# EAGLE design e-cig_controller (EAGLE 7.2.0)

## Sheet 1 of 3: USB Charger
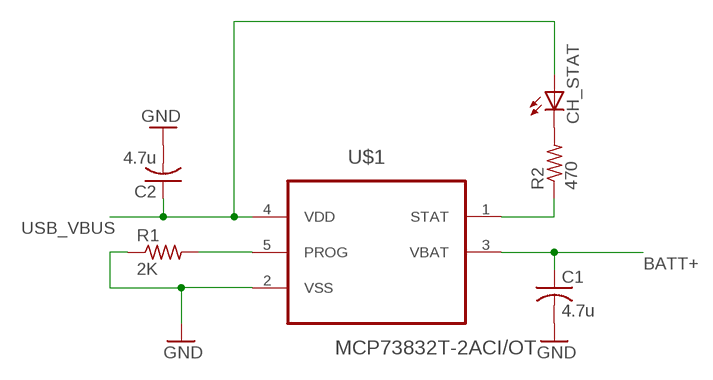
[diagram p0: schematic, sheet 1]

### Parts
C1  4.7u  C-USC0603  [C0603]
C2  4.7u  C-USC0603  [C0603]
CH_STAT  LEDCHIP-LED0603  [CHIP-LED0603]
R1  2K  R-US_R0603  [R0603]
R2  470  R-US_R0603  [R0603]
U$1  MCP73832T-2ACI/OT  [SOT95P280X145-5N]

### Nets
BATT+: C1.1 U$1.3(VBAT) ; also sheet 2
GND: C1.2 C2.2 R1.1 U$1.2(VSS) ; also sheet 2,3
N$2: R1.2 U$1.5(PROG)
N$3: CH_STAT.C R2.2
N$4: R2.1 U$1.1(STAT)
USB_VBUS: C2.1 CH_STAT.A U$1.4(VDD)

## Sheet 2 of 3: Power
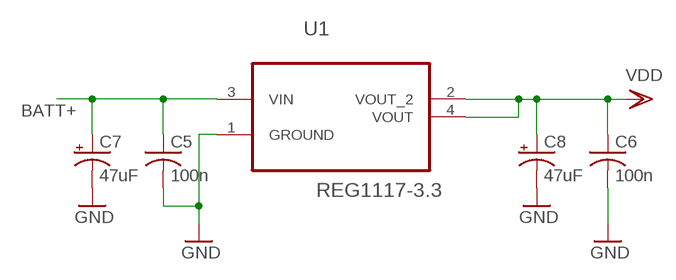
[diagram p1: schematic, sheet 2]

### Parts
C5  100n  C-USC0603  [C0603]
C6  100n  C-USC0603  [C0603]
C7  47uF  CPOL-USA/3216-18W  [A/3216-18W]
C8  47uF  CPOL-USA/3216-18W  [A/3216-18W]
U1  REG1117-3.3  [SOT230P700X180-4N]

### Nets
BATT+: C5.1 C7.+ U1.3(VIN) ; also sheet 1
GND: C5.2 C6.2 C7.- C8.- U1.1(GROUND) ; also sheet 1,3
VDD: C6.1 C8.+ U1.2(VOUT_2) U1.4(VOUT)

## Sheet 3 of 3: MCU
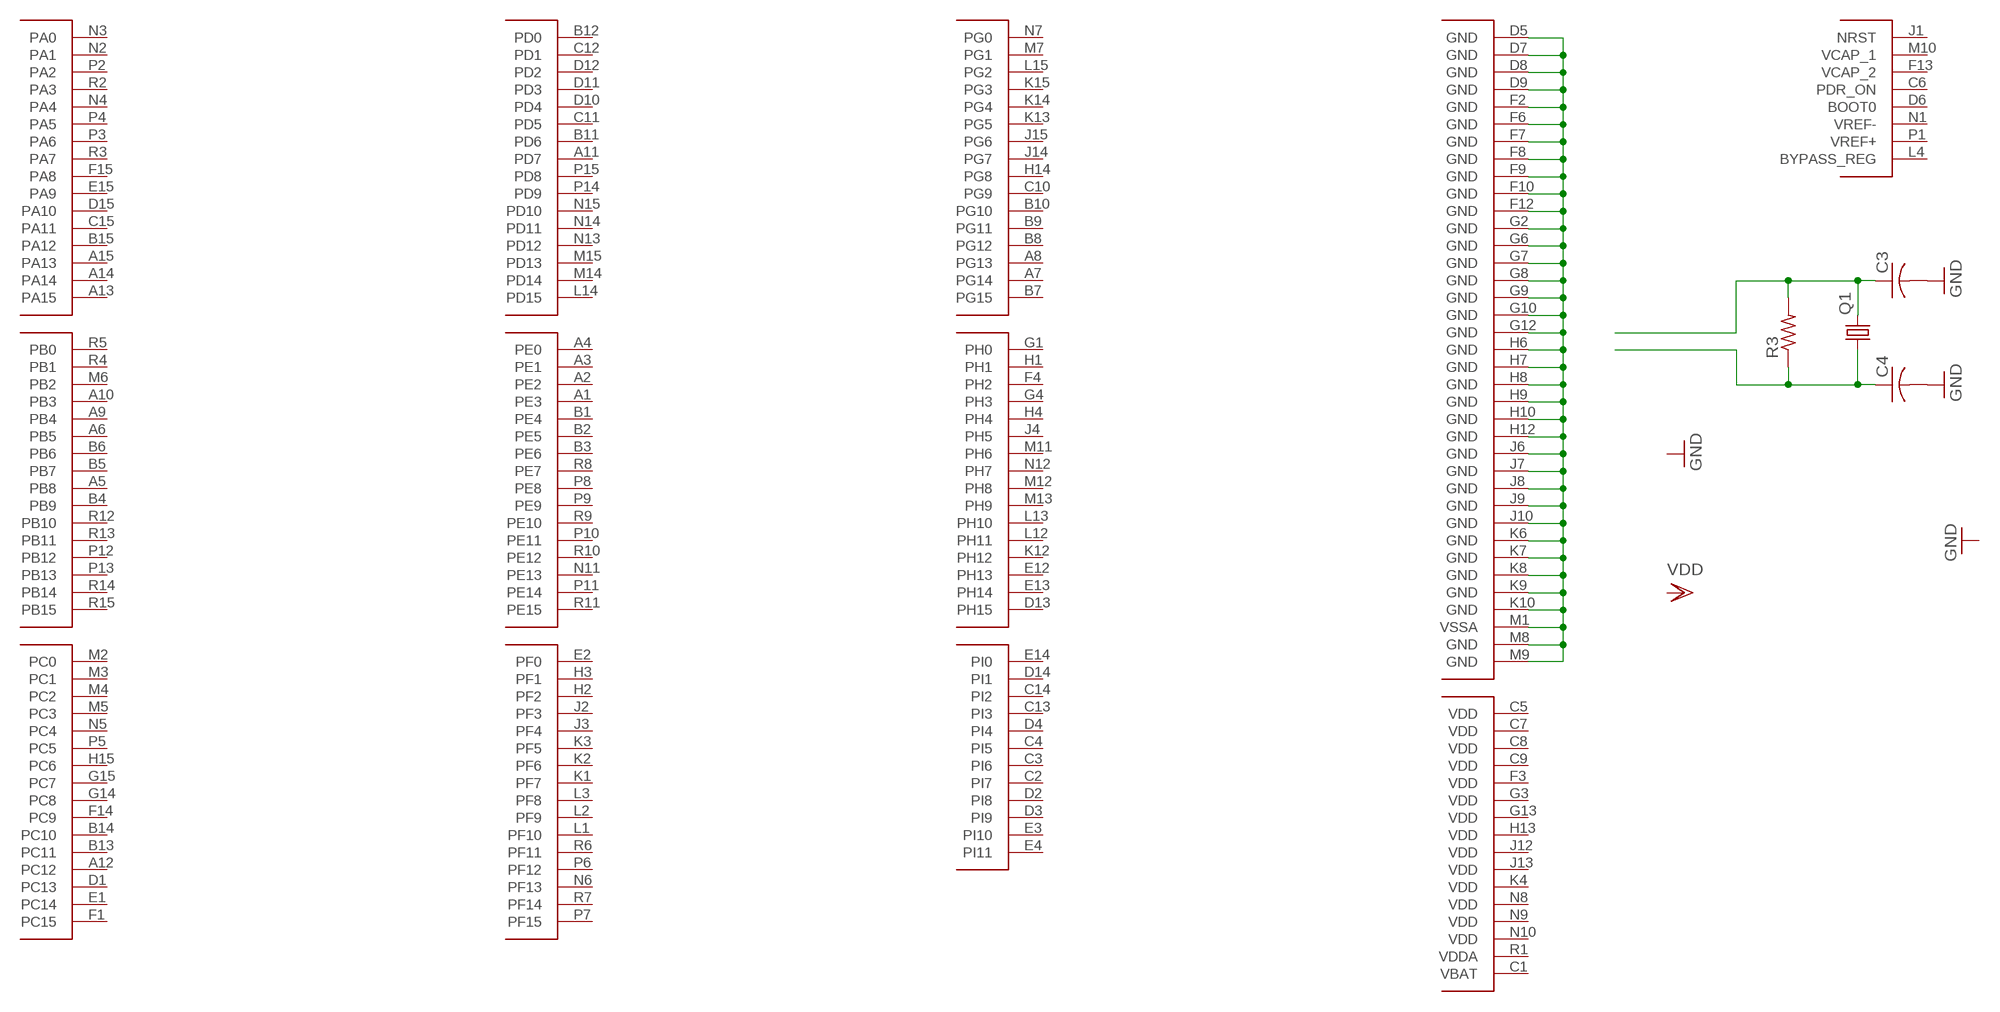
[diagram p2: schematic, sheet 3]

### Parts
C3  C-USC0603  [C0603]
C4  C-USC0603  [C0603]
Q1  CRYSTALHC49US  [HC49US]
R3  R-US_R0603  [R0603]
U$2  STM32F407IG  [UFBGA176+25]

### Nets
GND: C3.2 C4.2 ; also sheet 1,2
N$1: U$2.D5(GND) U$2.D7(GND) U$2.D8(GND) U$2.D9(GND) U$2.F2(GND) U$2.F6(GND) U$2.F7(GND) U$2.F8(GND) U$2.F9(GND) U$2.F10(GND) U$2.F12(GND) U$2.G2(GND) U$2.G6(GND) U$2.G7(GND) U$2.G8(GND) U$2.G9(GND) U$2.G10(GND) U$2.G12(GND) U$2.H6(GND) U$2.H7(GND) U$2.H8(GND) U$2.H9(GND) U$2.H10(GND) U$2.H12(GND) U$2.J6(GND) U$2.J7(GND) U$2.J8(GND) U$2.J9(GND) U$2.J10(GND) U$2.K6(GND) U$2.K7(GND) U$2.K8(GND) U$2.K9(GND) U$2.K10(GND) U$2.M1(VSSA) U$2.M8(GND) U$2.M9(GND)
N$6: C3.1 Q1.2 R3.2
N$7: C4.1 Q1.1 R3.1
Unconnected: U$2.A1(PE3) U$2.A2(PE2) U$2.A3(PE1) U$2.A4(PE0) U$2.A5(PB8) U$2.A6(PB5) U$2.A7(PG14) U$2.A8(PG13) U$2.A9(PB4) U$2.A10(PB3) U$2.A11(PD7) U$2.A12(PC12) U$2.A13(PA15) U$2.A14 U$2.A15(PA13) U$2.B1(PE4) U$2.B2(PE5) U$2.B3(PE6) U$2.B4(PB9) U$2.B5(PB7) U$2.B6 U$2.B7(PG15) U$2.B8(PG12) U$2.B9(PG11) U$2.B10(PG10) U$2.B11(PD6) U$2.B12(PD0) U$2.B13(PC11) U$2.B14(PC10) U$2.B15(PA12) U$2.C1(VBAT) U$2.C2(PI7) U$2.C3(PI6) U$2.C4(PI5) U$2.C5(VDD) U$2.C6(PDR_ON) U$2.C7(VDD) U$2.C8(VDD) U$2.C9(VDD) U$2.C10(PG9) U$2.C11(PD5) U$2.C12(PD1) U$2.C13(PI3) U$2.C14(PI2) U$2.C15(PA11) U$2.D1(PC13) U$2.D2(PI8) U$2.D3(PI9) U$2.D4(PI4) U$2.D6(BOOT0) U$2.D10(PD4) U$2.D11(PD3) U$2.D12(PD2) U$2.D13(PH15) U$2.D14(PI1) U$2.D15(PA10) U$2.E1(PC14) U$2.E2(PF0) U$2.E3(PI10) U$2.E4(PI11) U$2.E12(PH13) U$2.E13(PH14) U$2.E14(PI0) U$2.E15(PA9) U$2.F1(PC15) U$2.F3(VDD) U$2.F4(PH2) U$2.F13(VCAP_2) U$2.F14(PC9) U$2.F15(PA8) U$2.G1(PH0) U$2.G3(VDD) U$2.G4(PH3) U$2.G13(VDD) U$2.G14(PC8) U$2.G15(PC7) U$2.H1 U$2.H2(PF2) U$2.H3(PF1) U$2.H4 U$2.H13(VDD) U$2.H14(PG8) U$2.H15(PC6) U$2.J1(NRST) U$2.J2(PF3) U$2.J3(PF4) U$2.J4(PH5) U$2.J12(VDD) U$2.J13(VDD) U$2.J14(PG7) U$2.J15(PG6) U$2.K1(PF7) U$2.K2(PF6) U$2.K3(PF5) U$2.K4(VDD) U$2.K12(PH12) U$2.K13(PG5) U$2.K14(PG4) U$2.K15(PG3) U$2.L1(PF10) U$2.L2(PF9) U$2.L3(PF8) U$2.L4(BYPASS_REG) U$2.L12(PH11) U$2.L13(PH10) U$2.L14(PD15) U$2.L15(PG2) U$2.M2(PC0) U$2.M3(PC1) U$2.M4(PC2) U$2.M5(PC3) U$2.M6(PB2) U$2.M7(PG1) U$2.M10(VCAP_1) U$2.M11(PH6) U$2.M12(PH8) U$2.M13(PH9) U$2.M14(PD14) U$2.M15(PD13) U$2.N1(VREF-) U$2.N2(PA1) U$2.N3(PA0) U$2.N4(PA4) U$2.N5(PC4) U$2.N6(PF13) U$2.N7(PG0) U$2.N8(VDD) U$2.N9(VDD) U$2.N10(VDD) U$2.N11(PE13) U$2.N12(PH7) U$2.N13(PD12) U$2.N14(PD11) U$2.N15(PD10) U$2.P1(VREF+) U$2.P2(PA2) U$2.P3(PA6) U$2.P4(PA5) U$2.P5(PC5) U$2.P6(PF12) U$2.P7(PF15) U$2.P8(PE8) U$2.P9(PE9) U$2.P10(PE11) U$2.P11(PE14) U$2.P12(PB12) U$2.P13(PB13) U$2.P14(PD9) U$2.P15(PD8) U$2.R1(VDDA) U$2.R2(PA3) U$2.R3(PA7) U$2.R4(PB1) U$2.R5(PB0) U$2.R6(PF11) U$2.R7(PF14) U$2.R8(PE7) U$2.R9(PE10) U$2.R10(PE12) U$2.R11(PE15) U$2.R12(PB10) U$2.R13(PB11) U$2.R14(PB14) U$2.R15(PB15)

## Library data of the parts
C1-C6 = rcl:C-US: CAPACITOR, American symbol
C7 C8 = rcl:CPOL-US: POLARIZED CAPACITOR, American symbol
CH_STAT = adafruit:LED: LED OSRAM: - CHIPLED LG R971, LG N971, LY N971, LG Q971, LY Q971, LO R971, LY R971 LH N974, LH R974 LS Q976, LO Q976, LY Q976 LO Q996 - Hyper CHIPLED LW Q18S LB Q993, LB Q99A, LB R99A - SideLED LS A670, LO A670, LY A670, LG A670, LP A670 LB A673, LV A673, LT A673, LW A673 LH A674 LY A675 LS A676, LA A676, LO A676, LY A676, LW A676 LS A679, LY A679, LG A679 - Hyper Micro SIDELED® LS Y876, LA Y876, LO Y876, LY Y876 LT Y87S - SmartLED LW L88C, LW L88S LB L89C, LB L89S, LG L890 LS L89K, LO L89K, LY L89K LS L896, LA L896, LO L896, LY L896 - TOPLED LS T670, LO T670, LY T670, LG T670, LP T670 LSG T670, LSP T670, LSY T670, LOP T670, LYG T670 LG T671, LOG T671, LSG T671 LB T673, LV T673, LT T673, LW T673 LH T674 LS T676, LA T676, LO T676, LY T676, LB T676, LH T676, LSB T676, LW T676 LB T67C, LV T67C, LT T67C, LS T67K, LO T67K, LY T67K, LW E67C LS E67B, LA E67B, LO E67B, LY E67B, LB E67C, LV E67C, LT E67C LW T67C LS T679, LY T679, LG T679 LS T770, LO T770, LY T770, LG T770, LP T770 LB T773, LV T773, LT T773, LW T773 LH T774 LS E675, LA E675, LY E675, LS T675 LS T776, LA T776, LO T776, LY T776, LB T776 LHGB T686 LT T68C, LB T68C - Hyper Mini TOPLED® LB M676 - Mini TOPLED Santana® LG M470 LS M47K, LO M47K, LY M47K Source: http://www.osram.convergy.de/
Q1 = SparkFun:CRYSTAL: Crystals Various standard crystals. Proven footprints. Spark Fun Electronics SKU : COM-00534
R1-R3 = rcl:R-US_: RESISTOR, American symbol
U1 = Texas Instruments_By_element14_Batch_1:REG1117-3.3: Low Dropout Positive Regulator; MPN: REG1117-3.3; OC_FARNELL: 1212355; OC_NEWARK: 35C1963; PACKAGE: SOT-223-4; SUPPLIER: Texas Instruments
U$1 = Microchip_By_element14_Batch_1:MCP73832T-2ACI/OT: Charge Management Controller; MPN: MCP73832T-2ACI/OT; OC_FARNELL: 1332159; OC_NEWARK: 88K5656; PACKAGE: SOT-5; SUPPLIER: Microchip
U$2 = stm32_32bit_mcu:STM32F407IG

## Board
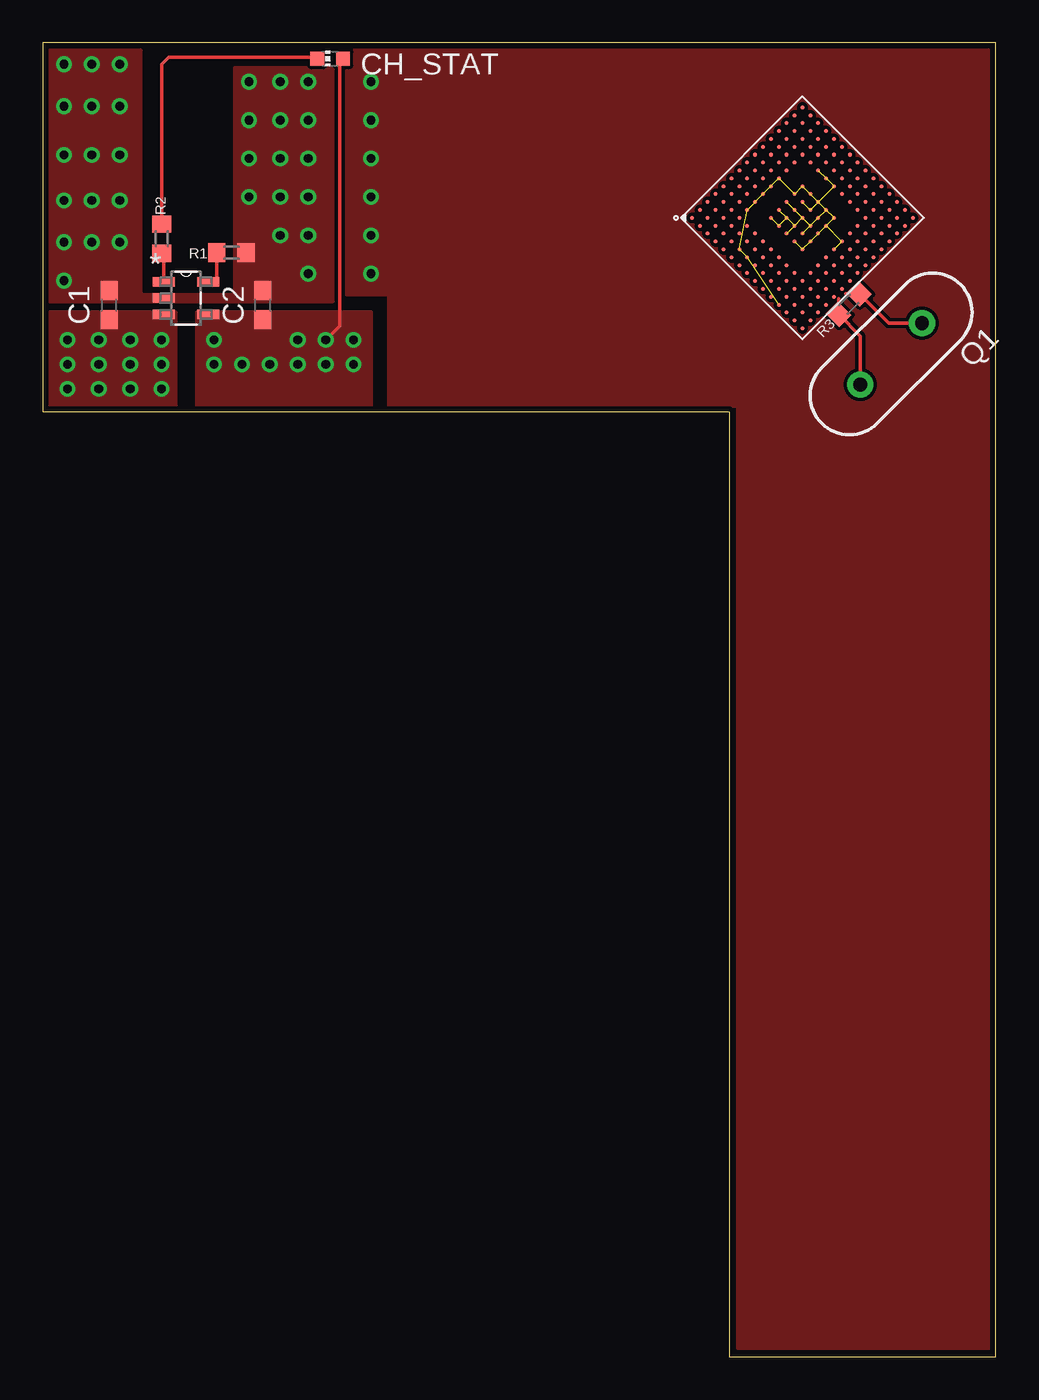
[diagram p3: board, top side]
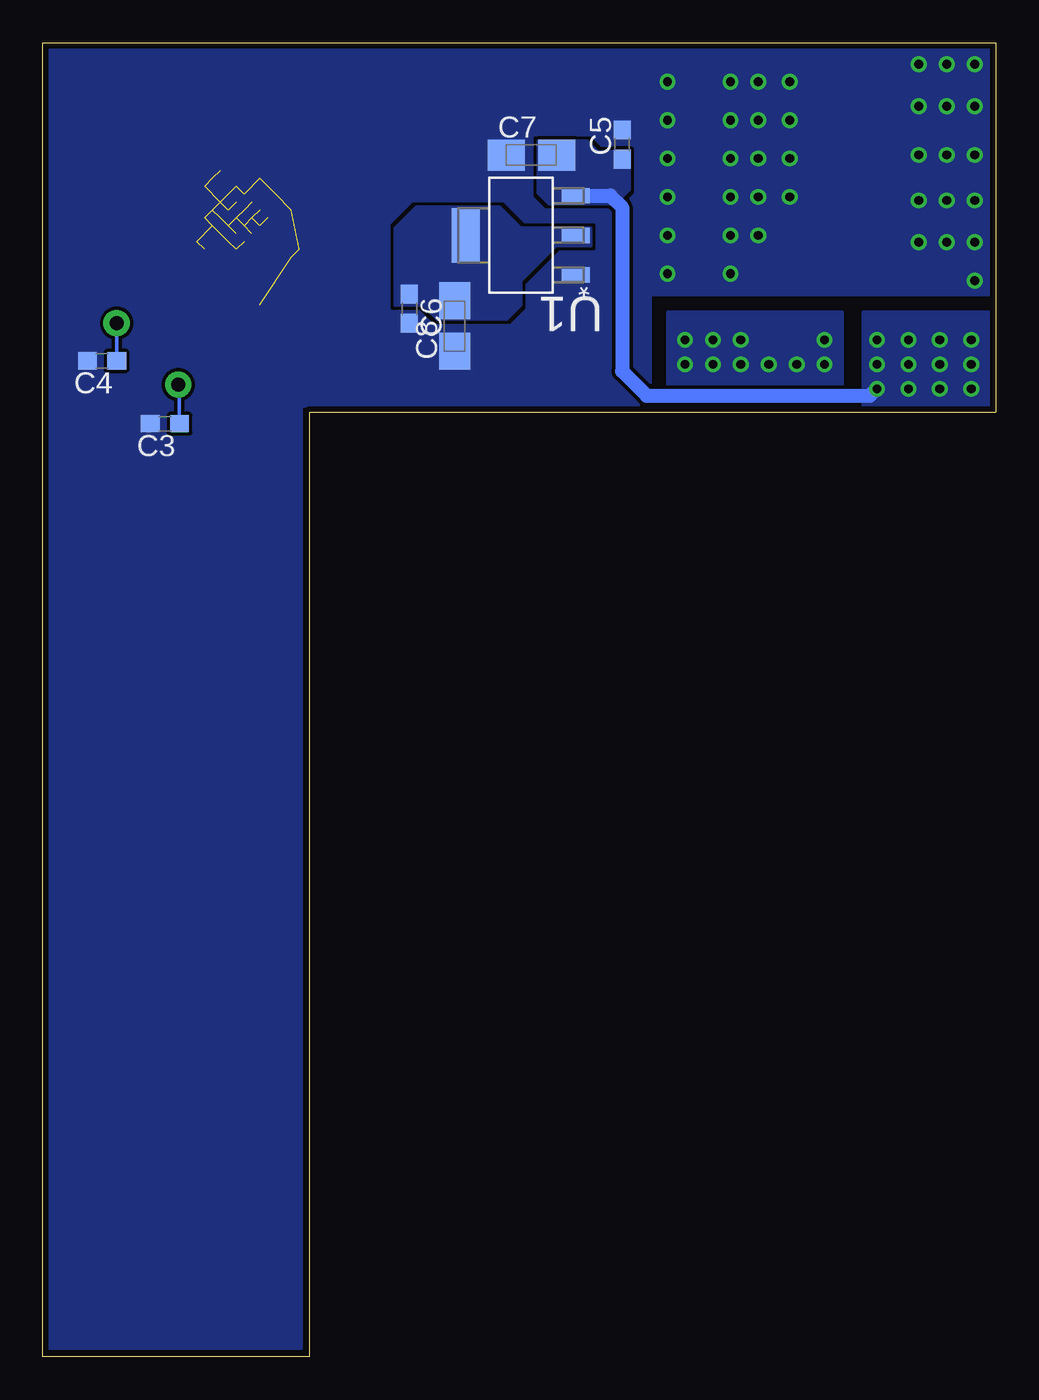
[diagram p4: board, bottom side, seen from below]

Size 55.46 x 76.5 mm. Coordinates in mm from the lower left corner, seen from the top.
Outline: 39.96,0 55.46,0 55.46,76.5 0,76.5 0,55 39.96,55 39.96,0
Copper layers (1*16): Top 0.035mm / dielectric 1.5mm / Bottom 0.035mm
Design rules "default *": minimum track width 5mil, minimum drill 10mil, track to track 8mil, track to pad 8mil, pad to pad 8mil, via to via 8mil, smd to smd 8mil, copper to edge 13mil, drill to drill 8mil, minimum pad ring 14mil, minimum via ring 8mil, stop-mask expansion 4mil, vias tented up to drill 0mil, thermal gap 10mil

### Footprints (pad centres in the part's own frame; a part is rotated, then mirrored left to right if it is on the bottom)
C0603 = smd 1.1 x 1: 1 -0.85,0; 2 0.85,0
A/3216-18W = smd 2.15 x 1.8: + 1.475,0; - -1.475,0
CHIP-LED0603 = smd 0.8 x 0.8: A 0,-0.75; C 0,0.75
HC49US = drill 0.813: 1 -2.54,0; 2 2.54,0
R0603 = smd 1 x 1.1: 1 -0.85,0; 2 0.85,0
SOT230P700X180-4N = smd 1.626 x 0.889: 1 -3.2,2.311; 2 -3.2,0; 3 -3.2,-2.311 | smd 1.626 x 3.175: 4 3.2,0
SOT95P280X145-5N = smd 1.27 x 0.559: 1 -1.295,0.94; 2 -1.295,0; 3 -1.295,-0.94; 4 1.295,-0.94; 5 1.295,0.94
UFBGA176+25 = smd 0.23 x 0.23: A1 -4.55,4.55; A2 -3.9,4.55; A3 -3.25,4.55; A4 -2.6,4.55; A5 -1.95,4.55; A6 -1.3,4.55; A7 -0.65,4.55; A8 0,4.55; A9 0.65,4.55; A10 1.3,4.55; A11 1.95,4.55; A12 2.6,4.55; A13 3.25,4.55; A14 3.9,4.55; A15 4.55,4.55; B1 -4.55,3.9; B2 -3.9,3.9; B3 -3.25,3.9; B4 -2.6,3.9; B5 -1.95,3.9; B6 -1.3,3.9; B7 -0.65,3.9; B8 0,3.9; B9 0.65,3.9; B10 1.3,3.9; B11 1.95,3.9; B12 2.6,3.9; B13 3.25,3.9; B14 3.9,3.9; B15 4.55,3.9; C1 -4.55,3.25; C2 -3.9,3.25; C3 -3.25,3.25; C4 -2.6,3.25; C5 -1.95,3.25; C6 -1.3,3.25; C7 -0.65,3.25; C8 0,3.25; C9 0.65,3.25; C10 1.3,3.25; C11 1.95,3.25; C12 2.6,3.25; C13 3.25,3.25; C14 3.9,3.25; C15 4.55,3.25; D1 -4.55,2.6; D2 -3.9,2.6; D3 -3.25,2.6; D4 -2.6,2.6; D5 -1.95,2.6; D6 -1.3,2.6; D7 -0.65,2.6; D8 0,2.6; D9 0.65,2.6; D10 1.3,2.6; D11 1.95,2.6; D12 2.6,2.6; D13 3.25,2.6; D14 3.9,2.6; D15 4.55,2.6; E1 -4.55,1.95; E2 -3.9,1.95; E3 -3.25,1.95; E4 -2.6,1.95; E12 2.6,1.95; E13 3.25,1.95; E14 3.9,1.95; E15 4.55,1.95; F1 -4.55,1.3; F2 -3.9,1.3; F3 -3.25,1.3; F4 -2.6,1.3; F6 -1.3,1.3; F7 -0.65,1.3; F8 0,1.3; F9 0.65,1.3; F10 1.3,1.3; F12 2.6,1.3; F13 3.25,1.3; F14 3.9,1.3; F15 4.55,1.3; G1 -4.55,0.65; G2 -3.9,0.65; G3 -3.25,0.65; G4 -2.6,0.65; G6 -1.3,0.65; G7 -0.65,0.65; G8 0,0.65; G9 0.65,0.65; G10 1.3,0.65; G12 2.6,0.65; G13 3.25,0.65; G14 3.9,0.65; G15 4.55,0.65; H1 -4.55,0; H2 -3.9,0; H3 -3.25,0; H4 -2.6,0; H6 -1.3,0; H7 -0.65,0; H8 0,0; H9 0.65,0; H10 1.3,0; H12 2.6,0; H13 3.25,0; H14 3.9,0; H15 4.55,0; J1 -4.55,-0.65; J2 -3.9,-0.65; J3 -3.25,-0.65; J4 -2.6,-0.65; J6 -1.3,-0.65; J7 -0.65,-0.65; J8 0,-0.65; J9 0.65,-0.65; J10 1.3,-0.65; J12 2.6,-0.65; J13 3.25,-0.65; J14 3.9,-0.65; J15 4.55,-0.65; K1 -4.55,-1.3; K2 -3.9,-1.3; K3 -3.25,-1.3; K4 -2.6,-1.3; K6 -1.3,-1.3; K7 -0.65,-1.3; K8 0,-1.3; K9 0.65,-1.3; K10 1.3,-1.3; K12 2.6,-1.3; K13 3.25,-1.3; K14 3.9,-1.3; K15 4.55,-1.3; L1 -4.55,-1.95; L2 -3.9,-1.95; L3 -3.25,-1.95; L4 -2.6,-1.95; L12 2.6,-1.95; L13 3.25,-1.95; L14 3.9,-1.95; L15 4.55,-1.95; M1 -4.55,-2.6; M2 -3.9,-2.6; M3 -3.25,-2.6; M4 -2.6,-2.6; M5 -1.95,-2.6; M6 -1.3,-2.6; M7 -0.65,-2.6; M8 0,-2.6; M9 0.65,-2.6; M10 1.3,-2.6; M11 1.95,-2.6; M12 2.6,-2.6; M13 3.25,-2.6; M14 3.9,-2.6; M15 4.55,-2.6; N1 -4.55,-3.25; N2 -3.9,-3.25; N3 -3.25,-3.25; N4 -2.6,-3.25; N5 -1.95,-3.25; N6 -1.3,-3.25; N7 -0.65,-3.25; N8 0,-3.25; N9 0.65,-3.25; N10 1.3,-3.25; N11 1.95,-3.25; N12 2.6,-3.25; N13 3.25,-3.25; N14 3.9,-3.25; N15 4.55,-3.25; P1 -4.55,-3.9; P2 -3.9,-3.9; P3 -3.25,-3.9; P4 -2.6,-3.9; P5 -1.95,-3.9; P6 -1.3,-3.9; P7 -0.65,-3.9; P8 0,-3.9; P9 0.65,-3.9; P10 1.3,-3.9; P11 1.95,-3.9; P12 2.6,-3.9; P13 3.25,-3.9; P14 3.9,-3.9; P15 4.55,-3.9; R1 -4.55,-4.55; R2 -3.9,-4.55; R3 -3.25,-4.55; R4 -2.6,-4.55; R5 -1.95,-4.55; R6 -1.3,-4.55; R7 -0.65,-4.55; R8 0,-4.55; R9 0.65,-4.55; R10 1.3,-4.55; R11 1.95,-4.55; R12 2.6,-4.55; R13 3.25,-4.55; R14 3.9,-4.55; R15 4.55,-4.55

### Placement (x,y rotation side)
C1  3.86,61.23 90 top
C2  12.8,61.23 90 top
C3  48.36,54.33 180 bottom
C4  52.02,57.98 180 bottom
C5  21.74,70.58 90 bottom
C6  34.14,61.03 270 bottom
C7  27.03,69.97 0 bottom
C8  31.5,60.02 90 bottom
CH_STAT  16.72,75.58 90 top
Q1  49.38,58.39 225 top
R1  10.97,64.28 180 top
R2  6.91,65.1 90 top
R3  46.91,61.29 225 top
U1  27.64,65.3 180 bottom
U$1  8.33,61.64 0 top
U$2  44.21,66.31 45 top

### Tracks (layer width: path | path; a pad name or v marks a point on that pad's centre or on a via)
BATT+  (via drill 0.51)
  Bottom 0.813: v6.91,56.36 7.31,55.95 20.32,55.95 21.74,57.37 21.74,66.92 22.43,67.61 U1.3
  other vias: 1.42,56.36 1.42,57.78 1.42,59.2 3.25,56.36 3.25,57.78 3.25,59.2 5.08,56.36 5.08,57.78 5.08,59.2 6.91,57.78 6.91,59.2
  pour Bottom (rank 5, no thermals): 0.41,60.83 7.72,60.83 7.72,55.34 0.41,55.34
  pour Top (rank 5, no thermals): 7.72,60.83 0.41,60.83 0.41,55.34 7.72,55.34
  pour Bottom (rank 5, no thermals): 21.34,70.18 23.16,70.18 23.77,70.78 26.62,70.78 26.62,67.74 26.01,67.13 22.15,67.13 21.34,67.94
GND  (via drill 0.51)
  other vias: 1.22,62.66 11.99,74.24 1.22,64.89 1.22,67.33 1.22,69.97 1.22,72.82 1.22,75.26 2.84,75.26 2.84,72.82 2.84,69.97 2.84,67.33 2.84,64.89 4.47,75.26 4.47,72.82 4.47,69.97 4.47,67.33 4.47,64.89 13.82,74.24 15.44,74.24 11.99,72 13.82,72 15.44,72 11.99,69.77 13.82,69.77 15.44,69.77 11.99,67.53 13.82,67.53 15.44,67.53 13.82,65.3 15.44,65.3 15.44,63.06 19.1,74.24 19.1,72 19.1,69.77 19.1,67.53 19.1,65.3 19.1,63.06
  pour Top (rank 6, no thermals): 0.41,61.44 0.41,76.07 5.69,76.07 5.69,61.84 11.18,61.84 11.18,75.05 16.87,75.05 16.87,61.44
  pour Bottom (rank 6, no thermals): 0.41,76.07 17.88,76.07 17.88,61.84 0.41,61.84
  pour Bottom (rank 6, no thermals): 20.12,55.34 20.12,61.84 14.83,61.84 14.83,76.07 55.07,76.07 55.07,0.48 40.44,0.48 40.44,55.34
  pour Top (rank 6, no thermals): 20.12,61.84 17.68,61.84 17.68,76.07 55.07,76.07 55.07,0.48 40.44,0.48 40.44,55.34 20.12,55.34
N$1  (36 unrouted)
N$2
  Top 0.203: U$1.5 10.12,62.58 R1.2
N$3
  Top 0.203: R2.2 6.91,75.25 7.31,75.66 15.49,75.66 CH_STAT.C
N$4
  Top 0.203: R2.1 7.04,64.25 U$1.1
N$6
  Top 0.203: 46.31,61.61 R3.2 47.58,59.42 Q1.2
  Bottom 0.203: Q1.2 47.51,56.52 C3.1
N$7
  Top 0.203: 46.74,61.89 R3.1 49.22,60.19 Q1.1
  Bottom 0.203: Q1.1 C4.1
USB_VBUS  (via drill 0.51)
  Top 0.203: v16.46,59.2 17.27,60.02 17.27,75.58 CH_STAT.A
  other vias: 16.46,57.78 9.96,57.78 11.58,57.78 13.21,57.78 14.83,57.78 9.96,59.2 18.08,57.78 18.08,59.2 14.83,59.2
  pour Top (rank 5, no thermals): 8.94,60.83 19.1,60.83 19.1,55.34 8.94,55.34
  pour Bottom (rank 5, no thermals): 8.94,60.83 19.1,60.83 19.1,56.56 8.94,56.56
VDD
  pour Bottom (rank 5, no thermals): 23.57,65.7 27.64,65.7 28.85,66.92 33.73,66.92 34.95,65.7 34.95,61.23 33.32,61.23 32.51,60.42 28.45,60.42 27.64,61.23 27.64,62.66 25.6,64.69 23.57,64.69